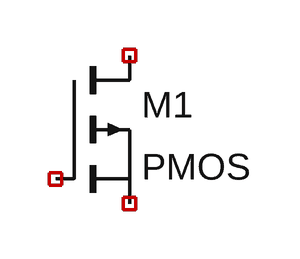
[diagram p0: schematic Draft2.asc]
Draft2.asc, the LTspice schematic file:
Version 4
SHEET 1 880 680
SYMBOL pmos 112 112 R0
SYMATTR InstName M1

The netlist it stands for:
* Draft2.asc
M1 NC_01 NC_02 NC_03 NC_03 PMOS
.model NMOS NMOS
.model PMOS PMOS
.lib standard.mos
.backanno
.end